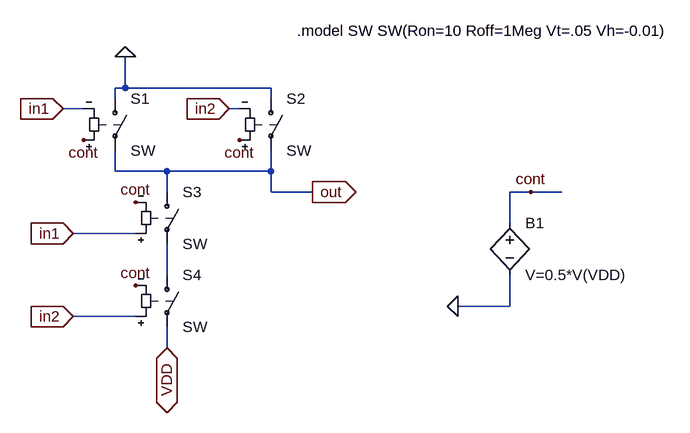
[diagram p0: schematic and2.asc]
and2.asc, the LTspice schematic file:
Version 4
SHEET 1 1084 680
WIRE 160 64 160 16
WIRE 160 64 144 64
WIRE 384 64 160 64
WIRE 144 80 144 64
WIRE 384 80 384 64
WIRE 96 96 64 96
WIRE 336 96 320 96
WIRE 144 192 144 160
WIRE 224 192 144 192
WIRE 384 192 384 160
WIRE 384 192 224 192
WIRE 224 224 224 192
WIRE 384 224 384 192
WIRE 448 224 384 224
WIRE 784 224 752 224
WIRE 832 224 784 224
WIRE 752 272 752 224
WIRE 176 288 80 288
WIRE 224 352 224 304
WIRE 752 400 752 352
WIRE 752 400 672 400
WIRE 176 416 80 416
WIRE 224 464 224 432
FLAG 64 96 in1
IOPIN 64 96 In
FLAG 80 288 in1
IOPIN 80 288 In
FLAG 80 416 in2
IOPIN 80 416 In
FLAG 320 96 in2
IOPIN 320 96 In
FLAG 224 464 VDD
IOPIN 224 464 BiDir
FLAG 448 224 out
IOPIN 448 224 Out
FLAG 672 400 0
FLAG 784 224 cont
FLAG 176 240 cont
FLAG 176 368 cont
FLAG 160 16 0
FLAG 96 144 cont
FLAG 336 144 cont
SYMBOL sw 144 64 R0
SYMATTR InstName S1
SYMBOL sw 384 64 R0
SYMATTR InstName S2
SYMBOL sw 224 208 R0
SYMATTR InstName S3
SYMBOL sw 224 336 R0
SYMATTR InstName S4
SYMBOL bv 752 256 R0
SYMATTR InstName B1
SYMATTR Value V=0.5*V(VDD)
TEXT 424 -24 Left 2 !.model SW SW(Ron=10 Roff=1Meg Vt=.05 Vh=-0.01)

The netlist it stands for:
* and2.asc
S1 0 out cont in1 SW
S2 0 out cont in2 SW
S3 out N001 in1 cont SW
S4 N001 VDD in2 cont SW
B1 cont 0 V=0.5*V(VDD)
.model SW SW(Ron=10 Roff=1Meg Vt=.05 Vh=-0.01)
.backanno
.end